# Altium schematic sheet Board Power.SchDoc: Board Power
size A4; SheetNumber: 1; SheetTotal: 5
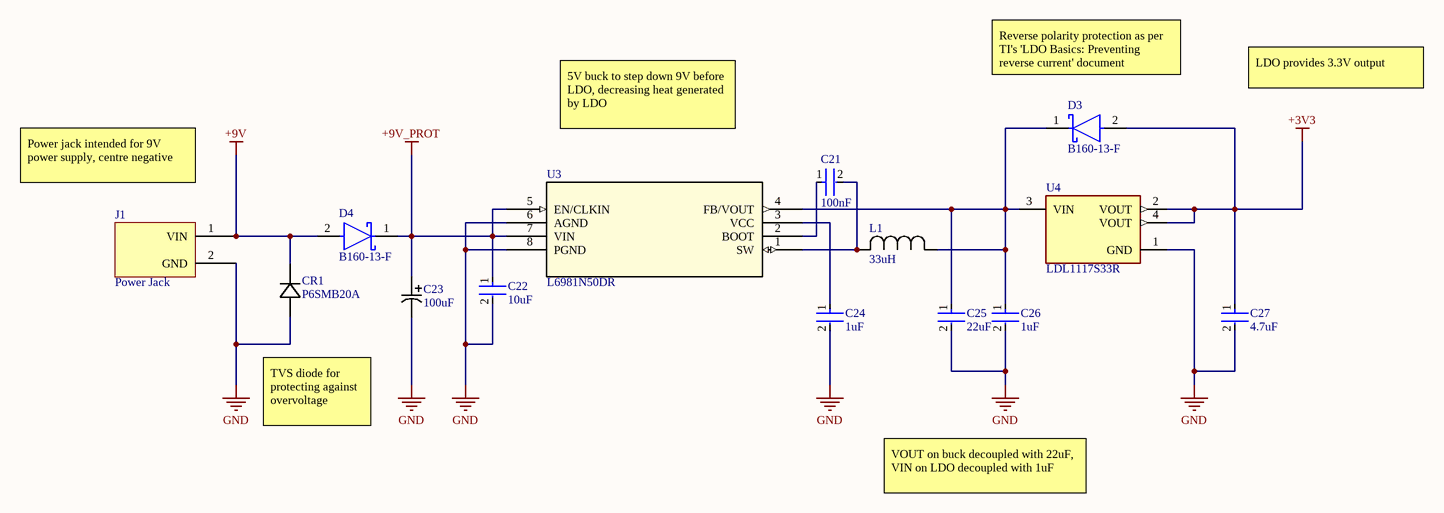
[diagram p0: Board Power.SchDoc]

## Parts
C21  100nF  [FP-CC0603-DA-MFG]
C22  10uF  [FP-GRM188-0_2-IPC_A]
C23  100uF  [CAP_EEFK_D8_PAN]
C24  1uF  [FP-CC0603-DA-MFG]
C25  22uF  [FP-GRM188-0_2-IPC_A]
C26  1uF  [FP-CC0603-DA-MFG]
C27  4.7uF  [FP-CC0603-DA-MFG]
CR1  P6SMB20A  [P6SMBSeries_LTF]
D3  B160-13-F  [FP-SMA-MFG]
D4  B160-13-F  [FP-SMA-MFG]
J1  Power Jack  [PowerJack]
L1  33uH  [IND_PCC-M0630M-LP_PAN]
U3  L6981N50DR  [SO8L_L6981N33DR_STM]
U4  LDL1117S33R  [FP-SOT223-0046067-IPC_C]

## Nets
+3V3: C27.1 D3.2(A) U4.2(VOUT) U4.4(VOUT)
+9V: CR1.1 D4.2(A) J1.1(VIN)
+9V_PROT: C22.1 C23.1 D4.1(C) U3.5(EN/CLKIN) U3.7(VIN)
GND: C22.2 C23.2 C24.2 C25.2 C26.2 C27.2 CR1.2 J1.2(GND) U3.6(AGND) U3.8(PGND) U4.1(GND)
NetC21_1: C21.1 U3.2(BOOT)
NetC21_2: C21.2 L1.2 U3.1(SW)
NetC24_1: C24.1 U3.3(VCC)
NetC25_1: C25.1 C26.1 D3.1(C) L1.1 U3.4(FB/VOUT) U4.3(VIN)

## Notes on the sheet
- 5V buck to step down 9V before LDO, decreasing heat generated by LDO
- Reverse polarity protection as per TI's 'LDO Basics: Preventing reverse current' document
- LDO provides 3.3V output
- Power jack intended for 9V power supply, centre negative
- TVS diode for protecting against overvoltage
- VOUT on buck decoupled with 22uF, VIN on LDO decoupled with 1uF

## Library data of the parts
C21 = CMP-03422-000081-1: CC0603 100 nF X7R 10.00% 25 V; Manufacturer Part Number: CC0603KPX7R8BB104; Manufacturer: YAGEO; Voltage: 25 V; Material: Ceramic; Tolerance: 0.1; Temperature Coefficient: 15%; Package: CC0603-DA; Capacitance: 100 nF; Device Class L2: Capacitors; Temperature Range High: +125°C; Automotive: No; Temperature Range Low: -55°C; Value: 100 nF; Device Class L1: Passive Components; Height: 0.9mm; RoHS: TRUE; Mouser Description: Multilayer Ceramic Capacitors MLCC - SMD/SMT 100nF 25V X7R 10%; Temperature Characteristic: X7R; Footprint Url: http://www.yageo.com/exep/pages/download/literatures/UPY-C_GEN_24.pdf; Octopart: https://octopart.com/cc0603kpx7r8bb104-yageo-12885111; Category: Cap; ComponentLink2Description: Datasheet; Voltage Rating: 25 V; Temperature: -55°C to +125°C; Device Class L3: Ceramic Capacitors; ComponentLink2URL: http://www.yageo.com/documents/recent/UPY-GPHC_X7R_6.3V-to-50V_18.pdf; Lead Free: Yes
C22 = CMP-06035-045268-1: Chip Multilayer Ceramic Capacitors for General Purpose, 0603, 10uF, X5R, 15%, 10%, 25V; Case/Package: 0603
C23 = EEE-FTH101XAP: Description; Manufacturer_Name: Panasonic; Copyright: Copyright (C) 2026 Ultra Librarian. All rights reserved.; Manufacturer_Part_Number: EEE-FTH101XAP
C24 C26 = CMP-2100-03598-2: CAP CER 1UF 25V X7R 0603; Manufacturer Part Number: CC0603KRX7R8BB105; Manufacturer: YAGEO; Tolerance: 0.1; Temperature Coefficient: 15%; Material: Ceramic; Value: 1 uF; ComponentLink2URL: http://www.yageo.com/documents/recent/UPY-GPHC_X7R_6.3V-to-50V_18.pdf; Temperature Range Low: -55°C; Temperature Range High: +125°C; Device Class L3: Ceramic Capacitors; Voltage: 25 V; Voltage Rating: 25 V; Capacitance: 1 uF; Mouser Description: 0603 1 uF 25 V ±10% Tolerance X7R SMT Multilayer Ceramic Capacitor; Footprint Url: http://www.yageo.com/exep/pages/download/literatures/UPY-C_GEN_24.pdf; Height: 0.9mm; Digikey Description: CAP CER 1UF 25V X7R 0603; Temperature: -55°C to +125°C; ComponentLink2Description: Datasheet; Device Class L2: Capacitors; Category: Cap; Lead Free: Yes; Octopart: https://octopart.com/cc0603krx7r8bb105-yageo-24490981; RoHS: TRUE; Package: CC0603-DA; Device Class L1: Passive Components; Temperature Characteristic: X7R; Automotive: No
C25 = CMP-06035-063651-1: Multilayer Ceramic Capacitor 22uF 20% 16V X5R 0603 Paper T/R
C27 = CMP-03422-001217-1: CAP CER 4.7UF 25V X5R 0603; Manufacturer: YAGEO; Manufacturer Part Number: CC0603KRX5R8BB475; Material: Ceramic; Temperature Coefficient: 15%; Tolerance: 0.1; Device Class L1: Passive Components; Temperature: -55°C to +125°C; Value: 4.7 uF; RoHS: TRUE; Temperature Range High: +125°C; Automotive: No; Lead Free: Yes; Digikey Description: CAP CER 4.7UF 25V X5R 0603; Category: Cap; Temperature Characteristic: X5R; Package: CC0603-DA; Device Class L2: Capacitors; Temperature Range Low: -55°C; Voltage Rating: 25 V; Capacitance: 4.7 uF; ComponentLink2URL: http://www.yageo.com/documents/recent/UPY-GPHC_X7R_6.3V-to-50V_18.pdf; Octopart: https://octopart.com/cc0603krx5r8bb475-yageo-77825350; Footprint Url: http://www.yageo.com/exep/pages/download/literatures/UPY-C_GEN_24.pdf; Device Class L3: Ceramic Capacitors; ComponentLink2Description: Datasheet; Voltage: 25 V; Height: 0.9mm
CR1 = P6SMB20A: Description; Manufacturer_Name: Littelfuse Inc; Copyright: Copyright (C) 2025 Ultra Librarian. All rights reserved.; Manufacturer_Part_Number: P6SMB20A
D3 D4 = CMP-2000-05885-2: DIODE SCHOTTKY 60V 1A SMA; Polarity: Standard; Element Configuration: Single; Peak Reverse Current: 500uA; Capacitance: 110pF; Peak Non-Repetitive Surge Current: 30A; Forward Voltage: 700mV; Termination: SMD/SMT; Radiation Hardening: No; Number of Pins: 2; Packaging: Tape and Reel; Length: 4.6mm; Current Rating: 1A; Lead Free: Lead Free; Output Current: 1A; Max Operating Temperature: 150°C; Min Operating Temperature: -65°C; Forward Current: 1A; Mount: Surface Mount; Width: 2.92mm; Average Rectified Current: 1A; Max Forward Surge Current (Ifsm): 30A; Voltage Rating (DC): 60V; Height: 2.1mm; REACH SVHC: No SVHC; Max Reverse Voltage (DC): 60V; Max Repetitive Reverse Voltage (Vrrm): 60V; Weight: 0.002258oz; Contact Plating: Tin; Case/Package: SMA; Package Quantity: 5000
L1 = ETQ-P3M330KVN: Description; Manufacturer_Name: Panasonic; Copyright: Copyright (C) 2026 Ultra Librarian. All rights reserved.; Manufacturer_Part_Number: ETQ-P3M330KVN
U3 = L6981N50DR: 38 V, 1.5 A synchronous step-down converter with 20 &#181;A quiescent current; Manufacturer_Name: STMicroelectronics; Copyright: Copyright (C) 2025 Ultra Librarian. All rights reserved.; Manufacturer_Part_Number: L6981N50DR; RefDes: RefDes; Type: Type
U4 = CMP-12153-000006-1: IC REG LINEAR 3.3V 1.2A SOT223; Manufacturer: STMicroelectronics; Output Type: Fixed; Min Supply Voltage: 2.6V; Number Of Outputs: 1; Dropout Voltage: 350mV; Output Current: 2A; Nominal Supply Current: 250uA; Standoff Height: 0.02mm; Max Supply Voltage: 18V; Max Junction Temp: +125°C; Accuracy Percentage: 2%; Automotive: No; Device Class L2: Power Management ICs; Height: 1.9mm; Octopart: https://octopart.com/ldl1117s33r-stmicroelectronics-81876163; Output Voltage: 3.3V; Package: SOT223-0046067; Lead Free: Yes; Temperature Range Low: -40°C; Category: IC; Device Class L1: Integrated Circuits (ICs); Ipc Land Pattern Name: SOT230P700X190-4; Mouser Description: LDL1117 Series 1.2 A 3.3 V High PSRR LDO Linear Voltage Regulator-SOT-223; ComponentLink2Description: Datasheet; ComponentLink2URL: https://www.st.com/resource/en/datasheet/ldl1117.pdf; Device Class L3: Voltage Regulators - Linear; Manufacturer Part Number: LDL1117S33R; Temperature Range High: +125°C; Digikey Description: IC REG LINEAR 3.3V 1.2A SOT223; Temperature: -40°C to +125°C; RoHS: TRUE